# EAGLE schematic TC board (EAGLE 6.3)
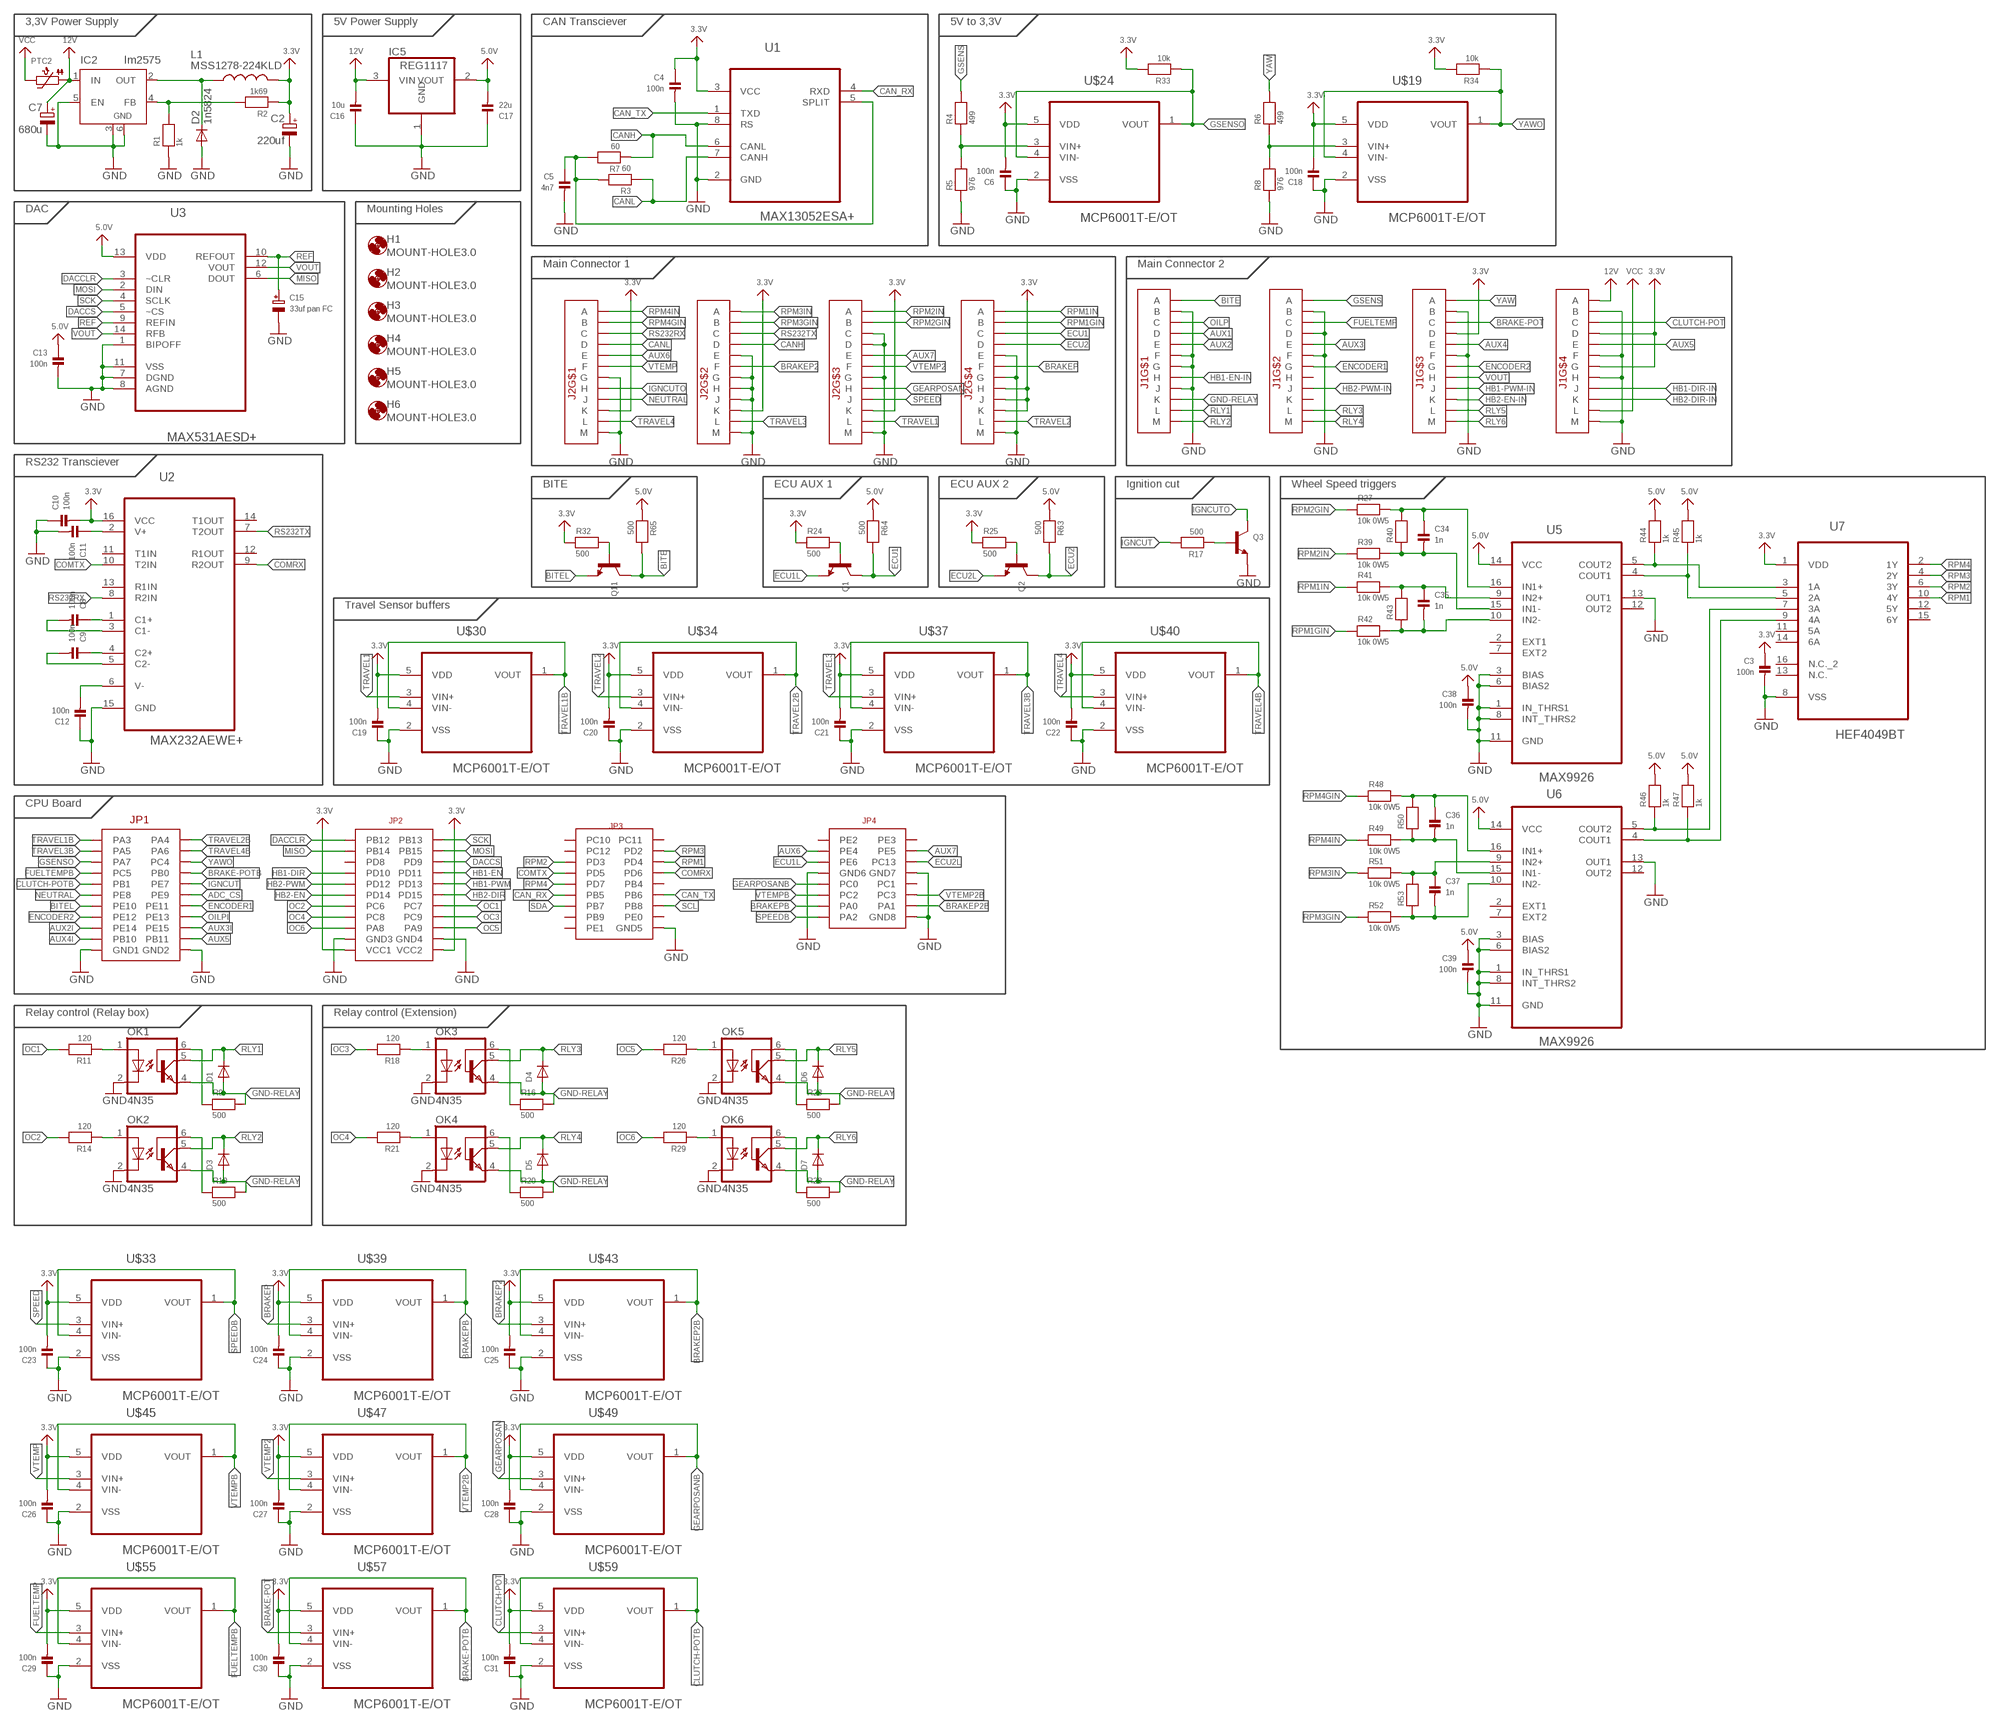
[diagram p0: schematic, sheet 1, part 1 of 2]
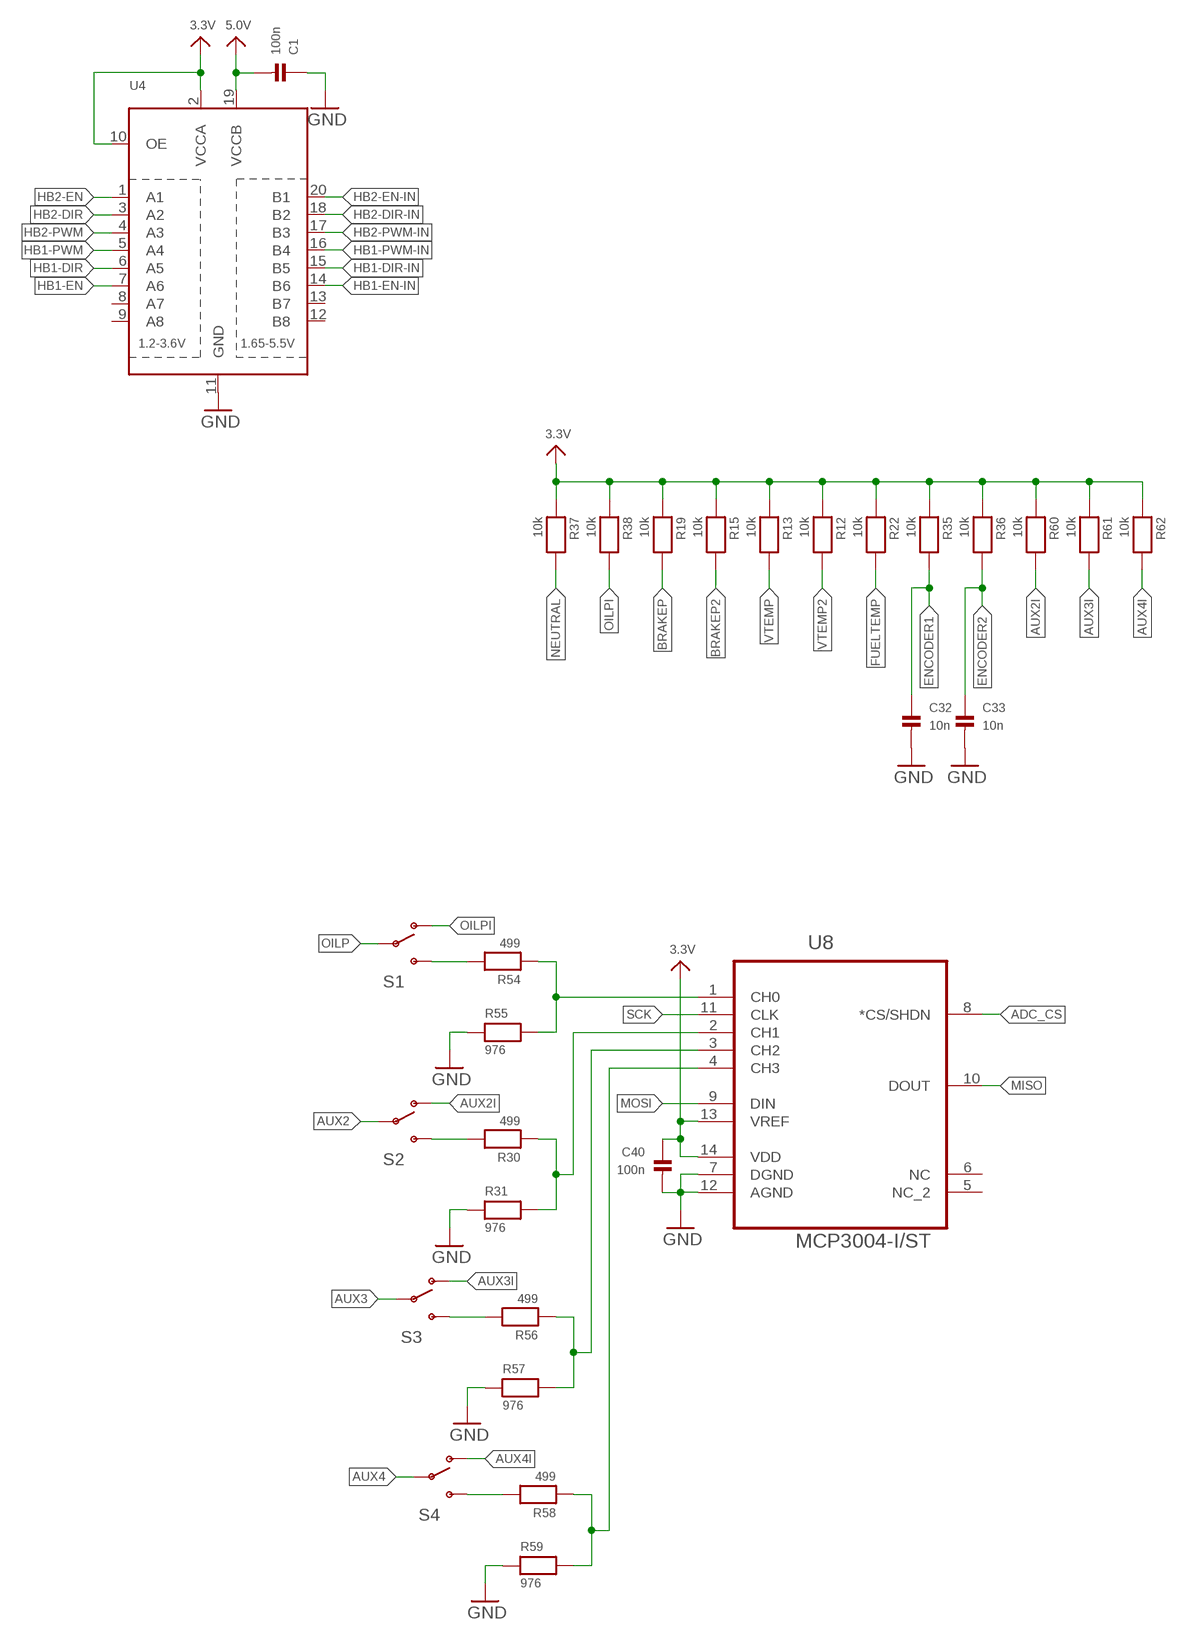
[diagram p1: schematic, sheet 1, part 2 of 2]

## Parts
C1  100n  CAP_CERAMIC_0603  [_0603]
C2  220uf  CPOL-EUE3.5-8  [E3,5-8]
C3  100n  CAP_CERAMIC_0603  [_0603]
C4  100n  CAP_CERAMIC_0603  [_0603]
C5  4n7  CAP_CERAMIC_0603  [_0603]
C6  100n  CAP_CERAMIC_0603  [_0603]
C7  680u  CPOL-EUE5-10.5  [E5-10,5]
C8  100n  CAP_CERAMIC_0603  [_0603]
C9  100n  CAP_CERAMIC_0603  [_0603]
C10  100n  CAP_CERAMIC_0603  [_0603]
C11  100n  CAP_CERAMIC_0603  [_0603]
C12  100n  CAP_CERAMIC_0603  [_0603]
C13  100n  CAP_CERAMIC_0603  [_0603]
C15  33uf pan FC  CAP_ELECTROLYTICPANASONIC_D  [PANASONIC_D]
C16  10u  CAP_CERAMIC_0805  [_0805]
C17  22u  CAP_CERAMIC_0805  [_0805]
C18  100n  CAP_CERAMIC_0603  [_0603]
C19  100n  CAP_CERAMIC_0603  [_0603]
C20  100n  CAP_CERAMIC_0603  [_0603]
C21  100n  CAP_CERAMIC_0603  [_0603]
C22  100n  CAP_CERAMIC_0603  [_0603]
C23  100n  CAP_CERAMIC_0603  [_0603]
C24  100n  CAP_CERAMIC_0603  [_0603]
C25  100n  CAP_CERAMIC_0603  [_0603]
C26  100n  CAP_CERAMIC_0603  [_0603]
C27  100n  CAP_CERAMIC_0603  [_0603]
C28  100n  CAP_CERAMIC_0603  [_0603]
C29  100n  CAP_CERAMIC_0603  [_0603]
C30  100n  CAP_CERAMIC_0603  [_0603]
C31  100n  CAP_CERAMIC_0603  [_0603]
C32  10n  CAP_CERAMIC_0603  [_0603]
C33  10n  CAP_CERAMIC_0603  [_0603]
C34  1n  CAP_CERAMIC_0603  [_0603]
C35  1n  CAP_CERAMIC_0603  [_0603]
C36  1n  CAP_CERAMIC_0603  [_0603]
C37  1n  CAP_CERAMIC_0603  [_0603]
C38  100n  CAP_CERAMIC_0603  [_0603]
C39  100n  CAP_CERAMIC_0603  [_0603]
C40  100n  CAP_CERAMIC_0603  [_0603]
D1  DIODESOD-323F  [SOD-323F]
D2  1n5824  1N5400  [DO201-15]
D3  DIODESOD-323F  [SOD-323F]
D4  DIODESOD-323F  [SOD-323F]
D5  DIODESOD-323F  [SOD-323F]
D6  DIODESOD-323F  [SOD-323F]
D7  DIODESOD-323F  [SOD-323F]
H1  MOUNT-HOLE3.0  [3,0]
H2  MOUNT-HOLE3.0  [3,0]
H3  MOUNT-HOLE3.0  [3,0]
H4  MOUNT-HOLE3.0  [3,0]
H5  MOUNT-HOLE3.0  [3,0]
H6  MOUNT-HOLE3.0  [3,0]
IC2  lm2575  LM2596S  [TO263-5]
IC5  REG1117  [SOT223]
J1  CON1  AUTOCONNECTOR  [AUTOCONNECTOR]
J2  CON1  AUTOCONNECTOR  [AUTOCONNECTOR]
L1  MSS1278-224KLD  INDUCTORPWR  [CDRH125]
OK1  4N35  [DIL06]
OK2  4N35  [DIL06]
OK3  4N35  [DIL06]
OK4  4N35  [DIL06]
OK5  4N35  [DIL06]
OK6  4N35  [DIL06]
PTC2  PTC1812  [PTC1812]
Q1  TRANSISTOR_NPNWIDE  [SOT23-WIDE]
Q2  TRANSISTOR_NPNWIDE  [SOT23-WIDE]
Q3  TRANSISTOR_NPNWIDE  [SOT23-WIDE]
Q11  TRANSISTOR_NPNWIDE  [SOT23-WIDE]
R1  1k  RESISTOR_0603  [_0603]
R2  1k69  RESISTOR_0603  [_0603]
R3  60  RESISTOR_0603  [_0603]
R4  499  RESISTOR_0603  [_0603]
R5  976  RESISTOR_0603  [_0603]
R6  499  RESISTOR_0603  [_0603]
R7  60  RESISTOR_0603  [_0603]
R8  976  RESISTOR_0603  [_0603]
R9  500  RESISTOR_0603  [_0603]
R10  500  RESISTOR_0603  [_0603]
R11  120  RESISTOR_0603  [_0603]
R12  10k  RESISTOR_0603  [_0603]
R13  10k  RESISTOR_0603  [_0603]
R14  120  RESISTOR_0603  [_0603]
R15  10k  RESISTOR_0603  [_0603]
R16  500  RESISTOR_0603  [_0603]
R17  500  RESISTOR_0603  [_0603]
R18  120  RESISTOR_0603  [_0603]
R19  10k  RESISTOR_0603  [_0603]
R20  500  RESISTOR_0603  [_0603]
R21  120  RESISTOR_0603  [_0603]
R22  10k  RESISTOR_0603  [_0603]
R23  500  RESISTOR_0603  [_0603]
R24  500  RESISTOR_0603  [_0603]
R25  500  RESISTOR_0603  [_0603]
R26  120  RESISTOR_0603  [_0603]
R27  10k 0W5  RESISTOR_0805  [_0805]
R28  500  RESISTOR_0603  [_0603]
R29  120  RESISTOR_0603  [_0603]
R30  499  RESISTOR_0603  [_0603]
R31  976  RESISTOR_0603  [_0603]
R32  500  RESISTOR_0603  [_0603]
R33  10k  RESISTOR_0603  [_0603]
R34  10k  RESISTOR_0603  [_0603]
R35  10k  RESISTOR_0603  [_0603]
R36  10k  RESISTOR_0603  [_0603]
R37  10k  RESISTOR_0603  [_0603]
R38  10k  RESISTOR_0603  [_0603]
R39  10k 0W5  RESISTOR_0805  [_0805]
R40  RESISTOR_0805  [_0805]
R41  10k 0W5  RESISTOR_0805  [_0805]
R42  10k 0W5  RESISTOR_0805  [_0805]
R43  RESISTOR_0805  [_0805]
R44  1k  RESISTOR_0603  [_0603]
R45  1k  RESISTOR_0603  [_0603]
R46  1k  RESISTOR_0603  [_0603]
R47  1k  RESISTOR_0603  [_0603]
R48  10k 0W5  RESISTOR_0805  [_0805]
R49  10k 0W5  RESISTOR_0805  [_0805]
R50  RESISTOR_0805  [_0805]
R51  10k 0W5  RESISTOR_0805  [_0805]
R52  10k 0W5  RESISTOR_0805  [_0805]
R53  RESISTOR_0805  [_0805]
R54  499  RESISTOR_0603  [_0603]
R55  976  RESISTOR_0603  [_0603]
R56  499  RESISTOR_0603  [_0603]
R57  976  RESISTOR_0603  [_0603]
R58  499  RESISTOR_0603  [_0603]
R59  976  RESISTOR_0603  [_0603]
R60  10k  RESISTOR_0603  [_0603]
R61  10k  RESISTOR_0603  [_0603]
R62  10k  RESISTOR_0603  [_0603]
R63  500  RESISTOR_0603  [_0603]
R64  500  RESISTOR_0603  [_0603]
R65  500  RESISTOR_0603  [_0603]
S1  SWITCH-SPDT-SMD-A  [SWITCH-SPST-SMD-A]
S2  SWITCH-SPDT-SMD-A  [SWITCH-SPST-SMD-A]
S3  SWITCH-SPDT-SMD-A  [SWITCH-SPST-SMD-A]
S4  SWITCH-SPDT-SMD-A  [SWITCH-SPST-SMD-A]
U1  MAX13052ESA+  [SOIC127P600X175-8N]
U2  MAX232AEWE+  [SOIC127P1032X265-16N]
U3  MAX531AESD+  [SOIC127P600X175-14N]
U4  TXB0108PWR  [TSSOP20]
U5  MAX9926  MAX9927AEE+  [SOP63P600X175-16N]
U6  MAX9926  MAX9927AEE+  [SOP63P600X175-16N]
U7  HEF4049BT  [SOIC127P600X175-16N]
U8  MCP3004-I/ST  [SOP65P640X120-14N]
U$1  CPU-BOARD  [CPU-BOARD-JP1]
U$19  MCP6001T-E/OT  [SOT95P270X145-5N]
U$24  MCP6001T-E/OT  [SOT95P270X145-5N]
U$30  MCP6001T-E/OT  [SOT95P270X145-5N]
U$33  MCP6001T-E/OT  [SOT95P270X145-5N]
U$34  MCP6001T-E/OT  [SOT95P270X145-5N]
U$37  MCP6001T-E/OT  [SOT95P270X145-5N]
U$39  MCP6001T-E/OT  [SOT95P270X145-5N]
U$40  MCP6001T-E/OT  [SOT95P270X145-5N]
U$43  MCP6001T-E/OT  [SOT95P270X145-5N]
U$45  MCP6001T-E/OT  [SOT95P270X145-5N]
U$47  MCP6001T-E/OT  [SOT95P270X145-5N]
U$49  MCP6001T-E/OT  [SOT95P270X145-5N]
U$55  MCP6001T-E/OT  [SOT95P270X145-5N]
U$57  MCP6001T-E/OT  [SOT95P270X145-5N]
U$59  MCP6001T-E/OT  [SOT95P270X145-5N]

## Nets
3.3V: C2.+ C3.1 C4.1 C6.2 C10.2 C18.2 C19.2 C20.2 C21.2 C22.2 C23.2 C24.2 C25.2 C26.2 C27.2 C28.2 C29.2 C30.2 C31.2 C40.1 J1.D3(D) J1.D4(D) J1.G4(G) J2.H4(H) J2.J4(J) J2.K1(K) J2.K2(K) J2.K3(K) J2.K4(K) L1.2 R2.1 R12.1 R13.1 R15.1 R19.1 R22.1 R24.1 R25.1 R32.1 R33.2 R34.2 R35.1 R36.1 R37.1 R38.1 R60.1 R61.1 R62.1 U1.3(VCC) U2.16(VCC) U4.2(VCCA) U4.10(OE) U7.1(VDD) U8.13(VREF) U8.14(VDD) U$1.P$43(VCC1) U$1.P$44(VCC2) U$19.5(VDD) U$24.5(VDD) U$30.5(VDD) U$33.5(VDD) U$34.5(VDD) U$37.5(VDD) U$39.5(VDD) U$40.5(VDD) U$43.5(VDD) U$45.5(VDD) U$47.5(VDD) U$49.5(VDD) U$55.5(VDD) U$57.5(VDD) U$59.5(VDD)
5.0V: C1.2 C13.1 C17.2 C38.1 C39.1 IC5.2(VOUT) R44.2 R45.2 R46.2 R47.2 R63.1 R64.1 R65.1 U3.13(VDD) U4.19(VCCB) U5.14(VCC) U6.14(VCC)
12V: C7.+ C16.2 IC2.1(IN) IC5.3(VIN) J1.A4(A) PTC2.P$1
ADC_CS: U8.8(*CS/SHDN) U$1.P$12(PE9)
AUX1: J1.D1(D)
AUX2: J1.E1(E) S2.2(P)
AUX2I: R60.2 S2.1(O) U$1.P$17(PE14)
AUX3: J1.E2(E) S3.2(P)
AUX3I: R61.2 S3.1(O) U$1.P$18(PE15)
AUX4: J1.E3(E) S4.2(P)
AUX4I: R62.2 S4.1(O) U$1.P$21(PB10)
AUX5: J1.E4(E) U$1.P$22(PB11)
AUX6: J2.E1(E) U$1.P$65(PE4)
AUX7: J2.E3(E) U$1.P$66(PE5)
BITE: J1.A1(A) Q11.3(C) R65.2
BITEL: Q11.2(E) U$1.P$13(PE10)
BRAKE-POT: J1.C3(C) U$57.3(VIN+)
BRAKE-POTB: U$1.P$8(PB0) U$57.1(VOUT) U$57.4(VIN-)
BRAKEP: J2.F4(F) R19.2 U$39.3(VIN+)
BRAKEP2: J2.F2(F) R15.2 U$43.3(VIN+)
BRAKEP2B: U$1.P$76(PA1) U$43.1(VOUT) U$43.4(VIN-)
BRAKEPB: U$1.P$75(PA0) U$39.1(VOUT) U$39.4(VIN-)
CAN_RX: U1.4(RXD) U$1.P$55(PB5)
CAN_TX: U1.1(TXD) U$1.P$56(PB6)
CANH: J2.D2(D) R7.1 U1.6(CANL)
CANL: J2.D1(D) R3.1 U1.7(CANH)
CLUTCH-POT: J1.C4(C) U$59.3(VIN+)
CLUTCH-POTB: U$1.P$9(PB1) U$59.1(VOUT) U$59.4(VIN-)
COMRX: U2.9(R2OUT) U$1.P$52(PD6)
COMTX: U2.10(T2IN) U$1.P$51(PD5)
DACCLR: U3.3(~CLR) U$1.P$23(PB12)
DACCS: U3.5(~CS) U$1.P$28(PD9)
ECU1: J2.C4(C) Q1.3(C) R64.2
ECU1L: Q1.2(E) U$1.P$67(PE6)
ECU2: J2.D4(D) Q2.3(C) R63.2
ECU2L: Q2.2(E) U$1.P$68(PC13)
ENCODER1: C32.1 J1.G2(G) R35.2 U$1.P$14(PE11)
ENCODER2: C33.1 J1.G3(G) R36.2 U$1.P$15(PE12)
FUELTEMP: J1.C2(C) R22.2 U$55.3(VIN+)
FUELTEMPB: U$1.P$7(PC5) U$55.1(VOUT) U$55.4(VIN-)
GEARPOSAN: J2.H3(H) U$49.3(VIN+)
GEARPOSANB: U$1.P$71(PC0) U$49.1(VOUT) U$49.4(VIN-)
GND: C1.1 C2.- C3.2 C4.2 C5.2 C6.1 C7.- C10.1 C11.2 C12.1 C13.2 C15.- C16.1 C17.1 C18.1 C19.1 C20.1 C21.1 C22.1 C23.1 C24.1 C25.1 C26.1 C27.1 C28.1 C29.1 C30.1 C31.1 C32.2 C33.2 C38.2 C39.2 C40.2 D2.A IC2.3(GND) IC2.5(EN) IC2.6(GND) IC5.1(GND) J1.B1(B) J1.B2(B) J1.B3(B) J1.B4(B) J1.D2(D) J1.F1(F) J1.F2(F) J1.F3(F) J1.F4(F) J1.G1(G) J1.H4(H) J1.J1(J) J1.M4(M) J2.C3(C) J2.D3(D) J2.E2(E) J2.E4(E) J2.G1(G) J2.G2(G) J2.G3(G) J2.G4(G) J2.H2(H) J2.J2(J) J2.M1(M) J2.M2(M) J2.M3(M) J2.M4(M) OK1.2(C) OK2.2(C) OK3.2(C) OK4.2(C) OK5.2(C) OK6.2(C) Q3.2(E) R1.1 R5.1 R8.1 R31.1 R55.1 R57.1 R59.1 U1.2(GND) U1.8(RS) U2.15(GND) U3.1(BIPOFF) U3.7(DGND) U3.8(AGND) U3.11(VSS) U4.11(GND) U5.1(IN_THRS1) U5.3(BIAS) U5.6(BIAS2) U5.8(INT_THRS2) U5.11(GND) U5.13(OUT1) U6.1(IN_THRS1) U6.3(BIAS) U6.6(BIAS2) U6.8(INT_THRS2) U6.11(GND) U6.13(OUT1) U7.8(VSS) U8.7(DGND) U8.12(AGND) U$1.P$19(GND1) U$1.P$20(GND2) U$1.P$41(GND3) U$1.P$42(GND4) U$1.P$62(GND5) U$1.P$69(GND6) U$1.P$70(GND7) U$1.P$78(GND8) U$19.2(VSS) U$24.2(VSS) U$30.2(VSS) U$33.2(VSS) U$34.2(VSS) U$37.2(VSS) U$39.2(VSS) U$40.2(VSS) U$43.2(VSS) U$45.2(VSS) U$47.2(VSS) U$49.2(VSS) U$55.2(VSS) U$57.2(VSS) U$59.2(VSS)
GND-RELAY: D1.A D3.A D4.A D5.A D6.A D7.A J1.K1(K) OK1.4(EMI) OK2.4(EMI) OK3.4(EMI) OK4.4(EMI) OK5.4(EMI) OK6.4(EMI) R9.2 R10.2 R16.2 R20.2 R23.2 R28.2
GSENS: J1.A2(A) R4.2
GSENSO: R33.1 U$1.P$5(PA7) U$24.1(VOUT) U$24.4(VIN-)
HB1-DIR: U4.6(A5) U$1.P$29(PD10)
HB1-DIR-IN: J1.J4(J) U4.15(B5)
HB1-EN: U4.7(A6) U$1.P$30(PD11)
HB1-EN-IN: J1.H1(H) U4.14(B6)
HB1-PWM: U4.5(A4) U$1.P$32(PD13)
HB1-PWM-IN: J1.J3(J) U4.16(B4)
HB2-DIR: U4.3(A2) U$1.P$34(PD15)
HB2-DIR-IN: J1.K4(K) U4.18(B2)
HB2-EN: U4.1(A1) U$1.P$33(PD14)
HB2-EN-IN: J1.K3(K) U4.20(B1)
HB2-PWM: U4.4(A3) U$1.P$31(PD12)
HB2-PWM-IN: J1.J2(J) U4.17(B3)
IGNCUT: R17.2 U$1.P$10(PE7)
IGNCUTO: J2.H1(H) Q3.3(C)
MISO: U3.6(DOUT) U8.10(DOUT) U$1.P$25(PB14)
MOSI: U3.2(DIN) U8.9(DIN) U$1.P$26(PB15)
N$1: IC2.4(FB) R1.2 R2.2
N$2: D2.C IC2.2(OUT) L1.1
N$3: OK1.6(BAS) R9.1
N$4: Q11.1(B) R32.2
N$5: OK3.6(BAS) R16.1
N$6: OK1.1(A) R11.1
N$7: R4.1 R5.2 U$24.3(VIN+)
N$8: OK4.6(BAS) R20.1
N$9: OK2.6(BAS) R10.1
N$10: OK2.1(A) R14.1
N$11: C34.1 R27.2 R40.2 U5.16(IN1+)
N$12: C5.1 R3.2 R7.2 U1.5(SPLIT)
N$13: C12.2 U2.6(V-)
N$14: C9.1 U2.4(C2+)
N$15: C34.2 R39.2 R40.1 U5.15(IN1-)
N$16: OK3.1(A) R18.1
N$17: C35.1 R41.2 R43.2 U5.9(IN2+)
N$18: C35.2 R42.2 R43.1 U5.10(IN2-)
N$19: OK4.1(A) R21.1
N$20: C9.2 U2.5(C2-)
N$21: C8.2 U2.3(C1-)
N$22: C8.1 U2.1(C1+)
N$23: C11.1 U2.2(V+)
N$24: Q3.1(B) R17.1
N$25: OK5.6(BAS) R23.1
N$26: OK6.6(BAS) R28.1
N$27: OK5.1(A) R26.1
N$28: R44.1 U5.5(COUT2) U7.3(1A)
N$29: R46.1 U6.5(COUT2) U7.7(3A)
N$30: R30.2 S2.3(S)
N$31: R45.1 U5.4(COUT1) U7.5(2A)
N$32: R6.1 R8.2 U$19.3(VIN+)
N$33: R47.1 U6.4(COUT1) U7.9(4A)
N$34: Q1.1(B) R24.2
N$35: Q2.1(B) R25.2
N$36: C36.1 R48.2 R50.2 U6.16(IN1+)
N$38: OK6.1(A) R29.1
N$39: C37.1 R51.2 R53.2 U6.9(IN2+)
N$40: C37.2 R52.2 R53.1 U6.10(IN2-)
N$41: C36.2 R49.2 R50.1 U6.15(IN1-)
N$42: R54.1 R55.2 U8.1(CH0)
N$43: R30.1 R31.2 U8.2(CH1)
N$46: R56.2 S3.3(S)
N$53: R56.1 R57.2 U8.3(CH2)
N$57: R54.2 S1.3(S)
N$62: R58.2 S4.3(S)
N$65: R58.1 R59.2 U8.4(CH3)
NEUTRAL: J2.J1(J) R37.2 U$1.P$11(PE8)
OC1: R11.2 U$1.P$36(PC7)
OC2: R14.2 U$1.P$35(PC6)
OC3: R18.2 U$1.P$38(PC9)
OC4: R21.2 U$1.P$37(PC8)
OC5: R26.2 U$1.P$40(PA9)
OC6: R29.2 U$1.P$39(PA8)
OILP: J1.C1(C) S1.2(P)
OILPI: R38.2 S1.1(O) U$1.P$16(PE13)
REF: C15.+ U3.9(REFIN) U3.10(REFOUT)
RLY1: D1.C J1.L1(L) OK1.5(COL)
RLY2: D3.C J1.M1(M) OK2.5(COL)
RLY3: D4.C J1.L2(L) OK3.5(COL)
RLY4: D5.C J1.M2(M) OK4.5(COL)
RLY5: D6.C J1.L3(L) OK5.5(COL)
RLY6: D7.C J1.M3(M) OK6.5(COL)
RPM1: U7.10(4Y) U$1.P$50(PD4)
RPM1GIN: J2.B4(B) R42.1
RPM1IN: J2.A4(A) R41.1
RPM2: U7.6(3Y) U$1.P$49(PD3)
RPM2GIN: J2.B3(B) R27.1
RPM2IN: J2.A3(A) R39.1
RPM3: U7.4(2Y) U$1.P$48(PD2)
RPM3GIN: J2.B2(B) R52.1
RPM3IN: J2.A2(A) R51.1
RPM4: U7.2(1Y) U$1.P$53(PD7)
RPM4GIN: J2.B1(B) R48.1
RPM4IN: J2.A1(A) R49.1
RS232RX: J2.C1(C) U2.8(R2IN)
RS232TX: J2.C2(C) U2.7(T2OUT)
SCK: U3.4(SCLK) U8.11(CLK) U$1.P$24(PB13)
SCL: U$1.P$58(PB8)
SDA: U$1.P$57(PB7)
SPEED: J2.J3(J) U$33.3(VIN+)
SPEEDB: U$1.P$77(PA2) U$33.1(VOUT) U$33.4(VIN-)
TRAVEL1: J2.L3(L) U$30.3(VIN+)
TRAVEL1B: U$1.P$1(PA3) U$30.1(VOUT) U$30.4(VIN-)
TRAVEL2: J2.L4(L) U$34.3(VIN+)
TRAVEL2B: U$1.P$2(PA4) U$34.1(VOUT) U$34.4(VIN-)
TRAVEL3: J2.L2(L) U$37.3(VIN+)
TRAVEL3B: U$1.P$3(PA5) U$37.1(VOUT) U$37.4(VIN-)
TRAVEL4: J2.L1(L) U$40.3(VIN+)
TRAVEL4B: U$1.P$4(PA6) U$40.1(VOUT) U$40.4(VIN-)
VCC: J1.L4(L) PTC2.P$2
VOUT: J1.H3(H) U3.12(VOUT) U3.14(RFB)
VTEMP: J2.F1(F) R13.2 U$45.3(VIN+)
VTEMP2: J2.F3(F) R12.2 U$47.3(VIN+)
VTEMP2B: U$1.P$74(PC3) U$47.1(VOUT) U$47.4(VIN-)
VTEMPB: U$1.P$73(PC2) U$45.1(VOUT) U$45.4(VIN-)
YAW: J1.A3(A) R6.2
YAWO: R34.1 U$1.P$6(PC4) U$19.1(VOUT) U$19.4(VIN-)
Unconnected: J1.H2(H) J1.K2(K) U2.11(T1IN) U2.12(R1OUT) U2.13(R1IN) U2.14(T1OUT) U4.8(A7) U4.9(A8) U4.12(B8) U4.13(B7) U5.2(EXT1) U5.7(EXT2) U5.12(OUT2) U6.2(EXT1) U6.7(EXT2) U6.12(OUT2) U7.11(5A) U7.12(5Y) U7.13(N.C.) U7.14(6A) U7.15(6Y) U7.16(N.C._2) U8.5(NC_2) U8.6(NC) U$1.P$27(PD8) U$1.P$45(PC10) U$1.P$46(PC11) U$1.P$47(PC12) U$1.P$54(PB4) U$1.P$59(PB9) U$1.P$60(PE0) U$1.P$61(PE1) U$1.P$63(PE2) U$1.P$64(PE3) U$1.P$72(PC1)

## Notes on the sheet
- 3,3V Power Supply | 5V Power Supply | CAN Transciever | 5V to 3,3V
- DAC | Mounting Holes
- Main Connector 1 | Main Connector 2
- RS232 Transciever
- BITE | ECU AUX 1 | ECU AUX 2 | Ignition cut | Wheel Speed triggers
- Travel Sensor buffers
- CPU Board
- Relay control (Relay box) | Relay control (Extension)

## Library data of the parts
C1 C3-C6 C8-C13 C16-C40 = microbuilder:CAP_CERAMIC: Ceramic Capacitors 0402 - 0402 Surface Mount Capacitors 16pF 50V 5% [Digikey: 445-4899-2-ND] 18pF 50V 5% [Digikey: 490-1281-2-ND] 22pF 50V 5% [Digikey: 490-1283-2-ND] 68pF 50V 5% [Digikey: 490-1289-2-ND] 0.1uF 10V 10% [Digikey: 490-1318-2-ND] 1.0uF 6.3V 10% [Digikey: 490-1320-2-ND] 0603 - 0603 Surface Mount Capacitors 16 pF 50V 5% [Digikey: 445-5051-2-ND] 22 pF 50V [Digikey: PCC220ACVTR-ND] 33 pF 50V 5% [Digikey: 490-1415-1-ND] 56pF 50V 5% [Digikey: 490-1421-1-ND] 220pF 50V 5% [Digikey: 445-1285-1-ND] 680 pF 50V 2200 pF 50V 5% C0G [Digikey: 445-1297-1-ND] 5600 pF 100V 5% X7R [Digikey: 478-3711-1-ND] 0.1 µF 25V 10% [Digikey: PCC2277TR-ND] 0.22 µF 16V 10% X7R [Digikey: 445-1318-1-ND] 1.0 µF 25V 10% [Digikey: 445-5146-2-ND] 0603 - RF Specific 3pF 250V +/-0.1pF RF [Digikey: 712-1347-1-ND] 18 pF 250V 5% [Digikey: 478-3505-1-ND or 712-1322-1-ND] 56 pF 250V 5% C0G RF [Digikey: 490-4867-1-ND] 68 pF 250V RF [Digikey: 490-4868-1-ND] 0805 - 0805 Surface Mount Capacitors 220 pF 250V 2% RF Ceramic Capacitor [Digikey: 712-1398-1-ND] 1000 pF 50V 2% NP0 Ceramic Capacitor [Digikey: 478-3760-1-ND] 0.1 µF 25V 10% Ceramic Capacitor [Digikey: PCC1828TR-ND] 1.0 µF 16V 10% Ceramic Capacitor[Digikey: 490-1691-2-ND] 10.0 µF 10V 10% Ceramic Capacitor[Digikey: 709-1228-1-ND] 10.0 uF 16V 10% Ceramic Capacitor [Digikey: 478-5165-2-ND] 47 uF 6.3V 20% Ceramic Capacitor [Digikey: 587-1779-1-ND or 399-5506-1-ND] 1206 - 1206 Surface Mount Capacitors 47uF 10V 20% Ceramic Capacitor [Digikey: 490-5528-1-ND or 399-5508-1-ND or 445-6010-1-ND] 100uF 6.3V -20%, +80% Y5V Ceramic Capacitor (Digikey: 490-4512-1-ND, Mouser: 81-GRM31CF50J107ZE1L)
C2 C7 = rcl:CPOL-EU: POLARIZED CAPACITOR, European symbol
C15 = microbuilder:CAP_ELECTROLYTIC: Electrolytic Capacitors SMT PANASONIC_C - Size C Panasonic Electrolytic Aluminum Capacitor 47µF 16V 20% Electrolytic Capacitor [Digikey: PCE3890TR-ND] PANASONIC_D - Size D Panasonic Electrolytic Aluminum Capacitor 100µF 25V 20% Electrolytic Capacitor [Digikey: PCE3898TR-ND] PTH 3.5 mm grid, 8 mm diameter ... 3.5 mm grid, 10 mm diameter ...
D1 D3-D7 = adafruit:DIODE: Diode SMADIODE - SMA Surface Mount Package 20V 1A Schottky Diode Digikey: 641-1014-6-ND DO-1N4148 - Through Hole Small Current Diode SOD-123 20V 1 A (.5mV Vf) Schottky Diode - Digikey: MBRX120TPMSCT-ND SOD-323 10V 570mA (.38mV Vf, 3ns) Schottky Diode - Digikey: ZLLS410CT-ND SOD-523 30V 30mA Schottky Diode (RB751S-40TE61) - Digikey: RB751S-40TE61CT-ND SOT23-R/W - SOT23 Package (R = Solder Paste/Reflow Ovens, W = Hand-Soldering) BAT54Film 40V 300mA - Digikey: 497-7162-1-ND
D2 = diode:1N5400: DIODE standard rectifier, 3 A, 50 V (Motorola)
H1-H6 = holes:MOUNT-HOLE: MOUNTING HOLE with drill center marker
IC2 = linear:LM2596S: STEP-DOWN VOLTAGE REGULATOR
IC5 = burr-brown:REG1117: 800mA and 1A Low Dropout (LDO) Positive Regulator 1.8V, 2.5V, 2.85V, 3.3V, 5V, and Adj; MPN: REG1117; OC_FARNELL: 1097566; OC_NEWARK: 14P6981
J1 J2 = unicorn_v2:AUTOCONNECTOR
L1 = SparkFun-Passives:INDUCTOR: Inductors Basic Inductor/Choke - 0603 and 1206. Footprints are not proven and vary greatly between part numbers. INDUCTOR POWER 3.3UH 4.0A SMD 0.197" L x 0.197" W x 0.177" H (5.00mm x 5.00mm x 4.50mm)
OK1-OK6 = optocoupler:4N35: MOTOROLA OPTO COUPLER; MF: FAIRCHILD SEMICONDUCTOR; MPN: 4N35; OC_FARNELL: 1328375; OC_NEWARK: 72K9946
PTC2 = microbuilder:PTC: PTC (Resettable Fuse) 1206 Package 250mA PTC (16V Max, Time-to-Trip: 0.08s) - Digikey: F2110CT-ND 1210 Package 100mA PTC (30V Max, Time-to-Trip: 0.6s) - Digikey: MF-USMF010-2CT-ND 1812 Package 750mA PTC (24V Max, Time-to-Trip: 0.2s) - Digikey: MF-MSMF075/24-2CT-ND
Q1-Q3 Q11 = microbuilder:TRANSISTOR_NPN: NPN Transistor Transistor (NPN) 500mA 45V - BC817 [Digikey: 568-1631-1-ND] Transistor (NPN) 500mA 45V - BC817,215 [Mouser: 771-BC817-T/R] SOT23-R - SOT23 footprint optimised for use with solder paste and reflow ovens. SOT23-W - SOT23 footprint optimised for hand-soldering (larger pads).
R1-R65 = microbuilder:RESISTOR: Resistors 0402 - 0402 Surface Mount Package 22 Ohm 1% 1/16W [Digikey: 311-22.0LRTR-ND] 33 Ohm 5% 1/16W 1.0K 5% 1/16W 1.5K 5% 1/16W 2.0K 1% 1/16W 10.0K 1% 1/16W [Digikey: 311-10.0KLRTR-ND] 10.0K 5% 1/16W [Digikey: RMCF0402JT10K0TR-ND] 12.1K 1% 1/16W [Digikey: 311-22.0LRTR-ND] 100.0K 5% 1/16W 0603 - 0603 Surface Mount Package 0 Ohm 1/10 Watt 1% Resistor 15 Ohm 1/10 Watt 1% Resistor 33 Ohm 1/10 Watt 1% Resistor 49.9 Ohm 1/10 Watt 1% Resistor 100 Ohm 1/10 Watt 1% Resistor 150 Ohm 1/10 Watt 1% Resistor 240 Ohm 1/10 Watt 1% Resistor 390 Ohm 1/10 Watt 1% Resistor 560 Ohm 1/10 Watt 1% Resistor 680 Ohm 1/10 Watt 1% Resistor 750 Ohm 1/10 Watt 1% Resistor 1.0K Ohm 1/10 Watt 1% Resistor 1.5K Ohm 1/10 Watt 1% Resistor 2.0K Ohm 1/10 Watt 1% Resistor 2.2K Ohm 1/10 Watt 1% Resistor 3.3K Ohm 1/10 Watt 1% Resistor 4.7K Ohm 1/10 Watt 1% Resistor 10.0K Ohm 1/10 Watt 1% Resistor 12.0K Ohm 1/10 Watt 1% Resistor 12.1K Ohm 1/10 Watt 1% Resistor 20.0K Ohm 1/10 Watt 1% Resistor 33.0K Ohm 1/10 Watt 1% Resistor 100.0K Ohm 1/10 Watt 1% Resistor 0805 - 0805 Surface Mount Package 0 Ohm 1/8 Watt 1% Resistor 33 Ohm 1/8 Watt 1% Resistor 100 Ohm 1/8 Watt 1% Resistor 150 Ohm 1/8 Watt 1% Resistor 200 Ohm 1/8 Watt 1% Resistor 240 Ohm 1/8 Watt 1% Resistor 330 Ohm 1/8 Watt 1% Resistor 390 Ohm 1/8 Watt 1% Resistor 470 Ohm 1/8 Watt 1% Resistor 1.0K Ohm 1/8 Watt 1% Resistor 1.5K Ohm 1/8 Watt 1% Resistor 2.0K Ohm 1/8 Watt 1% Resistor 4.7K Ohm 1/8 Watt 1% Resistor 5.1K Ohm 1/8 Watt 1% Resistor 5.6K Ohm 1/8 Watt 1% Resistor 10.0K Ohm 1/8 Watt 1% Resistor 22.0K Ohm 1/8 Watt 1% Resistor 33.0K Ohm 1/8 Watt 1% Resistor 100K Ohm 1/8 Watt 1% Resistor 1206 - 1206 Surface Mount Package 2012 - 2010 Surface Mount Package 0.11 Ohm 1/2 Watt 1% Resistor - Digikey: RHM.11UCT-ND
S1-S4 = SparkFun-Electromechanical:SWITCH-SPDT: SPDT Switch Simple slide switch, Spark Fun Electronics SKU : COM-00102 DPDT SMT slide switch, AYZ0202, SWCH-08179; PROD_ID: SWCH-10651
U1 = Maxim_By_element14_Batch_1:MAX13052ESA+: Industry-Standard High-Speed CAN Transceivers with ±80V Fault Protection; MPN: MAX13052ESA+; OC_FARNELL: 1600112; OC_NEWARK: 99K2875; PACKAGE: SOIC-8; SUPPLIER: Maxim
U2 = Maxim_By_element14_Batch_1:MAX232AEWE+: +5V-Powered, Multichannel RS-232 Drivers/Receivers; MPN: MAX232AEWE+; OC_FARNELL: 9724400; OC_NEWARK: 67K4435; PACKAGE: SOIC-16; SUPPLIER: Maxim
U3 = Maxim_By_element14_Batch_1:MAX531AESD+: DAC; MPN: MAX531AESD+; OC_FARNELL: -; OC_NEWARK: 23K6158; PACKAGE: SOIC-14; SUPPLIER: Maxim
U4 = adafruit:TXB0108PWR: 8-Bit Bi-Directional Level Shifter 1.2V-3.6V (VCCA) to 1.65V-5.5V (VCCB) bi-directional level shifter with auto direction sensing. Max data rate - VCCA 1.8V: 20Mbps (50ns), VCCA 3.3V: 100Mbps (10ns) Digikey: 296-21527-1-ND
U5 U6 = Maxim_By_element14_Batch_1:MAX9927AEE+: Variable Reluctance Sensor Interfaces with Differential Input and Adaptive Peak; MPN: MAX9927AEE+; OC_FARNELL: 1845723; OC_NEWARK: 80P4723; PACKAGE: QSOP-16; SUPPLIER: Maxim
U7 = NXP_By_element14_Batch_1:HEF4049BT: Hex inverting buffers; MPN: HEF4049BT; OC_FARNELL: 1201290; OC_NEWARK: 25M9617; PACKAGE: SOIC-16; SUPPLIER: NXP
U8 = Microchip_By_element14_Batch_1:MCP3004-I/ST: IC, 10BIT ADC 4-CH, SMD; MPN: MCP3004-I/ST; OC_FARNELL: 1523365; OC_NEWARK: 74M3032; PACKAGE: 14TSSOP; SUPPLIER: Microchip
U$1 = unicorn_v2:CPU-BOARD
U$19 U$24 U$30 U$33 U$34 U$37 U$39 U$40 U$43 U$45 U$47 U$49 U$55 U$57 U$59 = Microchip_By_element14_Batch_1:MCP6001T-E/OT: 1 MHz, Low-Power Op Amp; MPN: MCP6001T-E/OT; OC_FARNELL: 1332116; OC_NEWARK: 34M7471; PACKAGE: SOT23-5; SUPPLIER: Microchip